# Altium schematic sheet ESP_2PIN_DS18_NTC.SchDoc
size A3
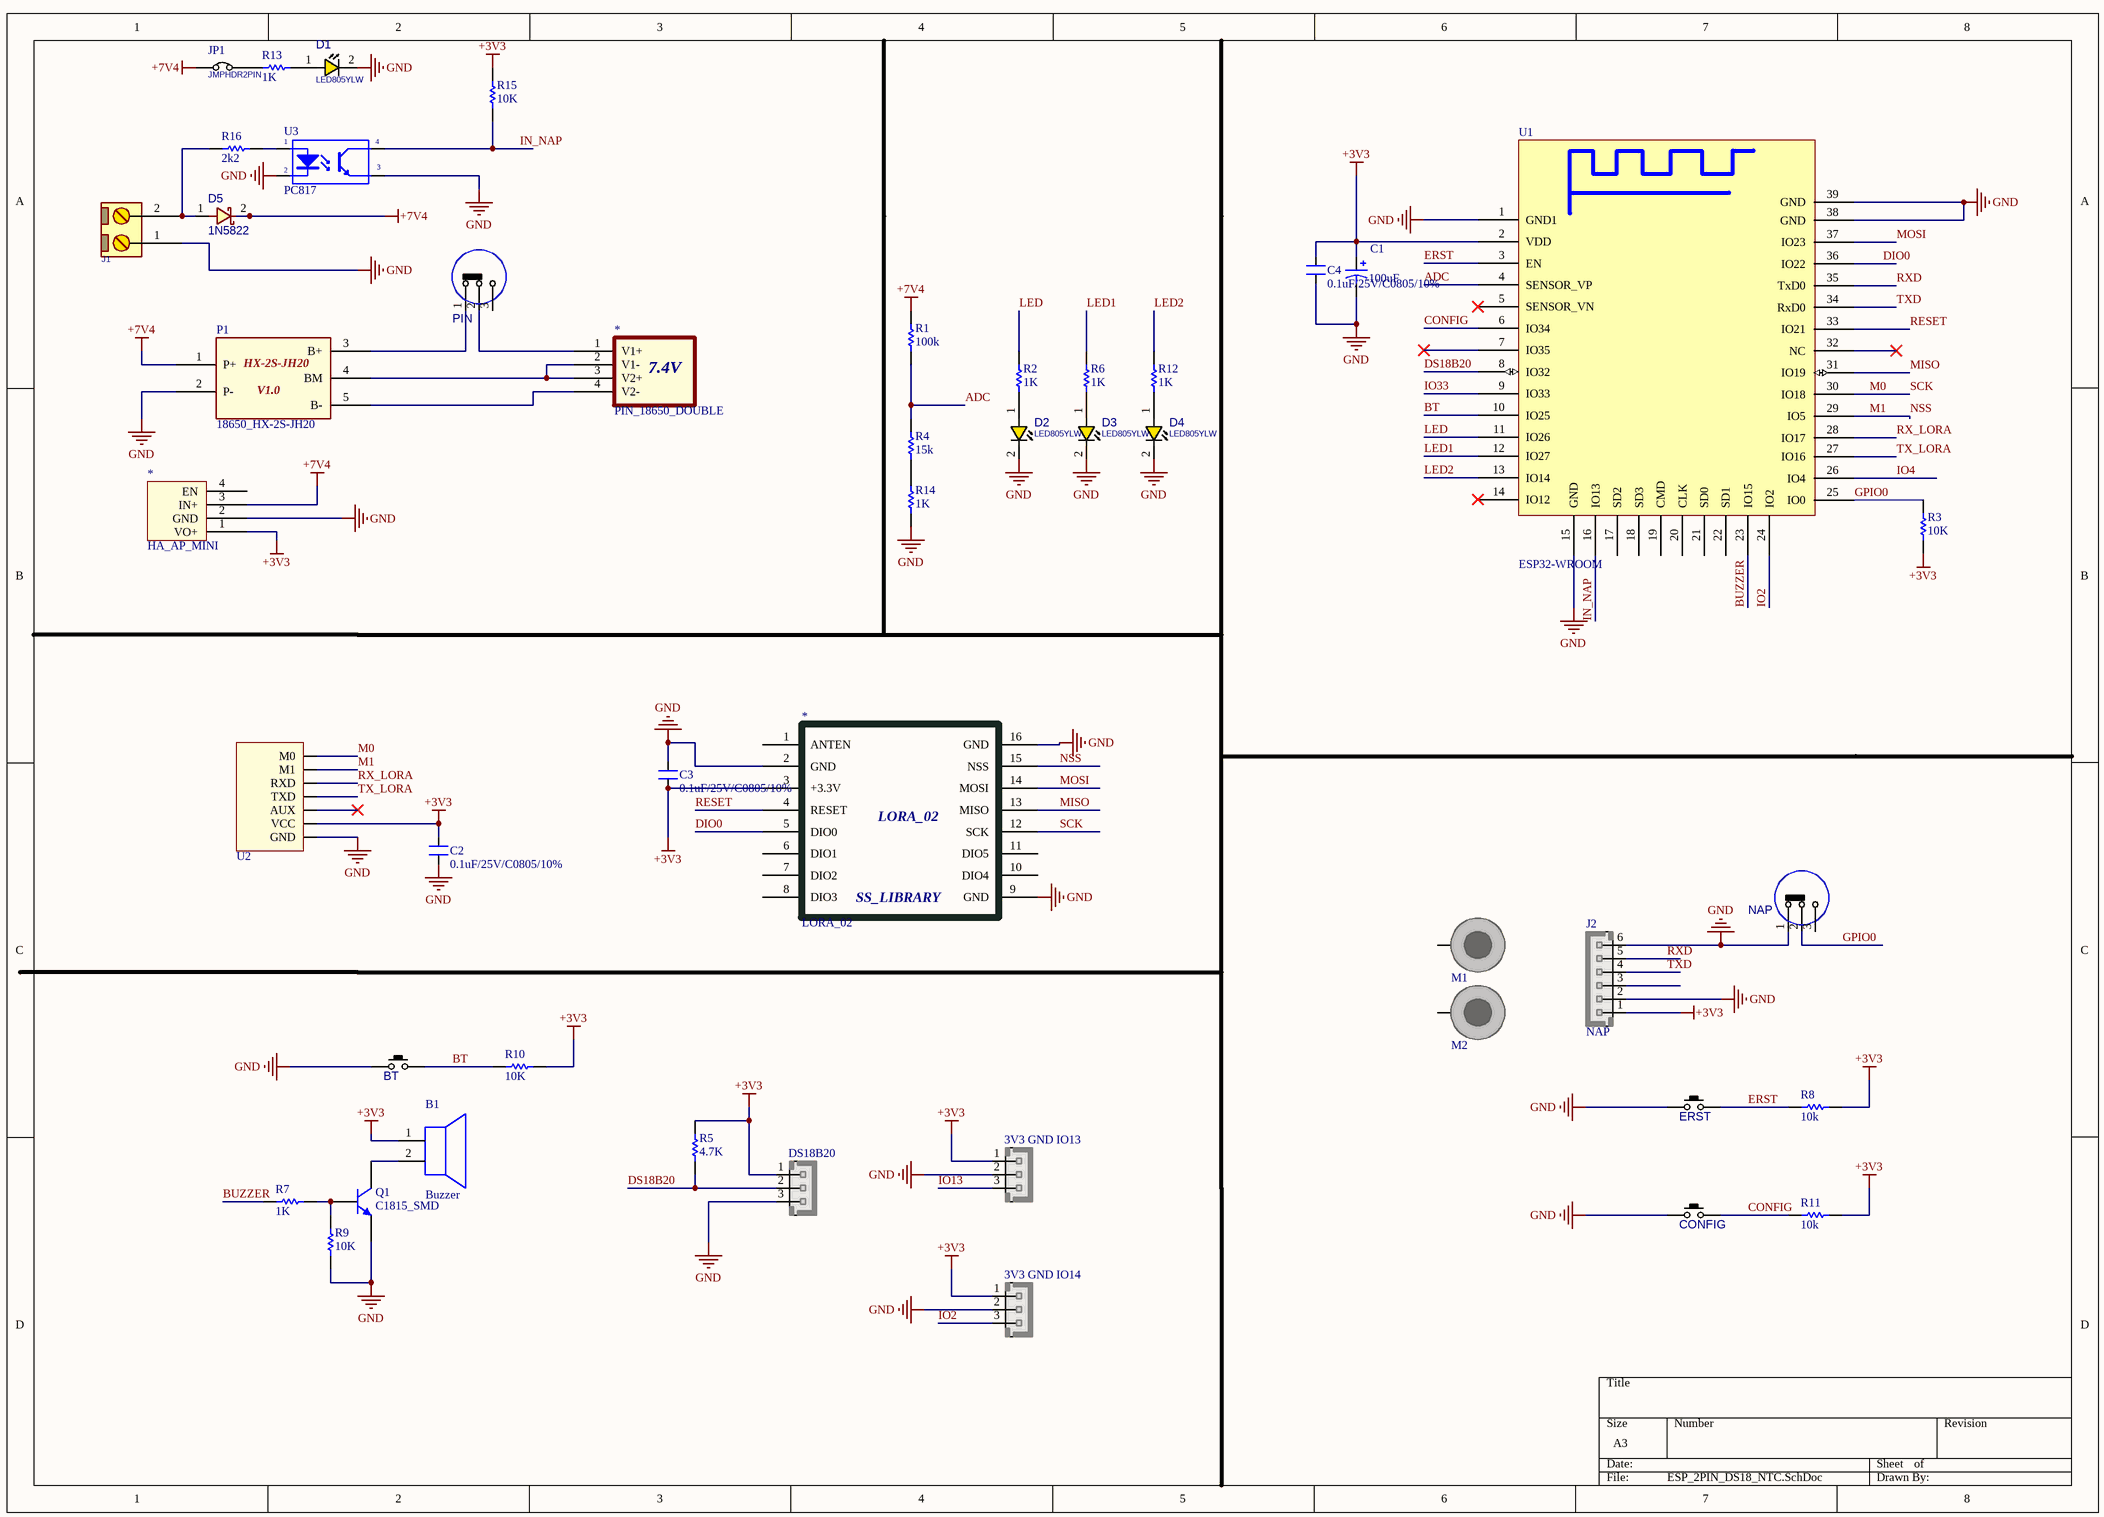
[diagram p0: ESP_2PIN_DS18_NTC.SchDoc]

## Parts
(Parts that share a designator on the sheet are numbered #1, #2 ... from top to bottom, then left to right.)
3V3_GND_IO13  HHDR_3  [XH_3]  (value not drawn)
3V3_GND_IO14  HHDR_3  [XH_3]  (value not drawn)
*#1  PIN_18650_DOUBLE  [2PIN_18650]
*#2  HA_AP_MINI  [HA_AP_MINI]
*#3  LORA_02  [LORA_02_SMD]
B1  Buzzer  [Buzzer]
BT  PUSHBUTTON  [SWPBS_SPST_6X3X5]  (value not drawn)
C1  100uF  [CAP TANT CASE X SMD]
C2  0.1uF/25V/C0805/10%  [CAP_CERA_C2012(CC0805INCH)]
C3  0.1uF/25V/C0805/10%  [CAP_CERA_C2012(CC0805INCH)]
C4  0.1uF/25V/C0805/10%  [CAP_CERA_C2012(CC0805INCH)]
CONFIG  PUSHBUTTON  [SWPBS_SPST_6X3X5]  (value not drawn)
D1  LED805YLW  [LED0805YLW]
D2  LED805YLW  [LED0805YLW]
D3  LED805YLW  [LED0805YLW]
D4  LED805YLW  [LED0805YLW]
D5  1N5822  [D_AX06_DO27]
DS18B20  HHDR_3  [XH_3]  (value not drawn)
ERST  PUSHBUTTON  [SWPBS_SPST_6X3X5]  (value not drawn)
J1  CONN_TB2  [TBG_2]  (value not drawn)
J2  NAP  [XH_6]
JP1  JMPHDR2PIN  [JUMP_2PIN]
M1  DNP/MH  [SCMH_M4FT]  (value not drawn)  (no BOM)
M2  DNP/MH  [SCMH_M4FT]  (value not drawn)  (no BOM)
NAP  SlideSwitch  [SWSLIDT_SPDT_S_8X4]  (value not drawn)
P1  18650_HX-2S-JH20  [18650_HX_2S]
PIN  SlideSwitch  [SWSLIDT_SPDT_S_8X4]  (value not drawn)
Q1  C1815_SMD  [trans_smd]
R1  100k  [Res 0805 SMD]
R2  1K  [Res 0805 SMD]
R3  10K  [Res 0805 SMD]
R4  15k  [Res 0805 SMD]
R5  4.7K  [Res 0805 SMD]
R6  1K  [Res 0805 SMD]
R7  1K  [Res 0805 SMD]
R8  10k  [Res 0805 SMD]
R9  10K  [Res 0805 SMD]
R10  10K  [Res 0805 SMD]
R11  10k  [Res 0805 SMD]
R12  1K  [Res 0805 SMD]
R13  1K  [Res 0805 SMD]
R14  1K  [Res 0805 SMD]
R15  10K  [Res 0805 SMD]
R16  2k2  [Res 0805 SMD]
U1  ESP32-WROOM  [ESP32-WROOM-32U - duplicate]
U2  RF_LoraE32  [RF_LoraE32]  (value not drawn)
U3  PC817  [DIP_4SMD]

## Nets
+3V3: 3V3_GND_IO13.1 3V3_GND_IO14.1 *#2.1(VO+) *#3.3(+3.3V) B1.1(+) C1.1 C2.2 C3.1 C4.2 DS18B20.1 J2.1 R3.1 R5.2 R8.1 R10.1 R11.1 R15.1 U1.2(VDD) U2.2(VCC)
+7V4: *#2.3(IN+) D5.2(K) JP1.1 P1.1(P+) R1.2
GND: 3V3_GND_IO13.2 3V3_GND_IO14.2 *#2.2(GND) *#3.2(GND) *#3.9(GND) *#3.16(GND) BT.1(P1) C1.2 C2.1 C3.2 C4.1 CONFIG.1(P1) D1.2(CATHODE) D2.2(CATHODE) D3.2(CATHODE) D4.2(CATHODE) DS18B20.3 ERST.1(P1) J1.1 J2.2 J2.6 NAP.1(P1) P1.2(P-) Q1.2(E) R9.1 R14.1 U1.1(GND1) U1.15(GND) U1.38(GND) U1.39(GND) U2.1(GND) U3.2(K) U3.3(E)
ADC: R1.1 R4.2 U1.4(SENSOR_VP)
BT: BT.2(P3) R10.2 U1.10(IO25)
BUZZER: R7.2 U1.23(IO15)
CONFIG: CONFIG.2(P3) R11.2 U1.6(IO34)
DIO0: *#3.5(DIO0) U1.36(IO22)
DS18B20: DS18B20.2 R5.1 U1.8(IO32)
ERST: ERST.2(P3) R8.2 U1.3(EN)
GPIO0: NAP.2(P3) R3.2 U1.25(IO0)
IN_NAP: R15.2 U1.16(IO13) U3.4(C)
IO2: 3V3_GND_IO14.3 U1.24(IO2)
IO4: U1.26(IO4)
IO13: 3V3_GND_IO13.3
IO33: U1.9(IO33)
LED: R2.2 U1.11(IO26)
LED1: R6.2 U1.12(IO27)
LED2: R12.2 U1.13(IO14)
M0: *#3.12(SCK) U1.30(IO18) U2.7(M0)  [also labelled SCK]
M1: *#3.15(NSS) U1.29(IO5) U2.6(M1)  [also labelled NSS]
MISO: *#3.13(MISO) U1.31(IO19)
MOSI: *#3.14(MOSI) U1.37(IO23)
RESET: *#3.4(RESET) U1.33(IO21)
RX_LORA: U1.28(IO17) U2.5(RXD)
RXD: J2.5 U1.35(TxD0)
TX_LORA: U1.27(IO16) U2.4(TXD)
TXD: J2.4 U1.34(RxD0)
Net*#1_1: *#1.1(V1+) PIN.2(P3)
Net*#1_2: *#1.2(V1-) *#1.3(V2+) P1.4(BM)
Net*#1_4: *#1.4(V2-) P1.5(B-)
NetB1_2: B1.2(-) Q1.3(C)
NetD1_1: D1.1(ANODE) R13.1
NetD2_1: D2.1(ANODE) R2.1
NetD3_1: D3.1(ANODE) R6.1
NetD4_1: D4.1(ANODE) R12.1
NetD5_1: D5.1(A) J1.2 R16.2
NetJP1_2: JP1.2 R13.2
NetP1_3: P1.3(B+) PIN.1(P1)
NetQ1_1: Q1.1(B) R7.1 R9.2
NetR4_1: R4.1 R14.2
NetR16_1: R16.1 U3.1(A)

Not connected (* = marked no-connect by the designer): *#2 4(EN); *#3 1(ANTEN) 6(DIO1) 7(DIO2) 8(DIO3) 10(DIO4) 11(DIO5); J2 3; M1 1; M2 1; NAP 3(P4); PIN 3(P4); U1 5(SENSOR_VN)* 7(IO35)* 14(IO12)* 17(SD2) 18(SD3) 19(CMD) 20(CLK) 21(SD0) 22(SD1) 32(NC)*; U2 3(AUX)*

## Notes on the sheet
- (in symbol 18650_HX-2S-JH20) HX-2S-JH20; V1.0
- (in symbol LORA_02) SS_LIBRARY
- (in symbol PIN_18650_DOUBLE) 7.4V

## Library data of the parts
3V3_GND_IO13 3V3_GND_IO14 DS18B20 = XH_3: JST-XH pitch: 2.5mm; VALUE: HHDR_3
BT CONFIG ERST = SWPBS_SPST_6X3X5: SWITCH, PUSH BUTTON, TACTILE, SMD, SPST, 6X3.5X5mm; MANF: ALPS; DESC: DESCRIPTION; MANF_P#: SKQMBBE010; VALUE: PUSHBUTTON; ASSEMBLY: ASSEMBLY; PARAM: PARAM; PRICE: PRICE
C1 = CAP_100uF/6.3V/SIZE B/20%: CAP TANT 100UF 6.3V 20% 1411; Manufacturer: Kemet; Manufacturer Part Number: T491B107M006AT; Manufacturer Size Code: B; Capacitance: 100µF; ESR (Equivalent Series Resistance): 3 Ohm; Type: Molded; Lifetime @ Temp.: 2000 Hrs @ 85°C; RoHS: RoHS Compliant; Category: Capacitors; Packaging: Cut Tape (CT); Tolerance: ±20%; Voltage - Rated: 6.3V; Operating Temperature: -55°C ~ 125°C; Mounting Type: Surface Mount; Package / Case: 1411 (3528 Metric); Size / Dimension: 0.138" L x 0.110" W (3.50mm x 2.80mm); Height - Seated (Max): 0.083" (2.10mm); Lead Spacing: -; Features: General Purpose; ComponentLink1URL: http://www.kemet.com/Lists/ProductCatalog/Attachments/254/KEM_T2005_T491.pdf; ComponentLink1Description: http://www.kemet.com/Lists/ProductCatalog/Attachments/254/KEM_T2005_T491.pdf; Supplier 1: Digi-Key; Supplier Part Number 1: 399-3710-1-ND
C2-C4 = CAP CERA 0805: CERAMIC CAP 0805; Value: 100pF, 2012
D1-D4 = LED_SMD_0805_YLW: LED, SMD, 0805, YELLOW; DESC: DESCRIPTION; MANF_P#: MANF_PART#; PARAM2: 2.2V; MANF: MANF; ASSEMBLY: ASSEMBLY; PRICE: 36t@Javan; VALUE: LED805YLW
D5 = DIODE_THD_SCHOTTKY_1N5822: DIODE, SCHOTTKY, 40V, 3A; MANF: Diodes; DESC: DESCRIPTION; MANF_P#: 1N5822; ASSEMBLY: ASSEMBLY; PRICE: PRICE; PARAM2: 3A; PARAM: 40V; VALUE: 1N5822
J1 = CONN_TB2: CONN, TERMINAL BLOCK, 5.08mm pitch; VALUE: CONN_TB2
J2 = XH_6: JST-XH pitch: 2.5mm; MANF_P#: JST-S6B-XHA; MANF: JST; VALUE: NAP
JP1 = JUMPER_HDR_2P: JUMPER, HEADER 2PIN; MANF: MANF; MANF_P#: MANF_P#; VALUE: JMPHDR2PIN
M1 M2 = SCMH_M4FT: SCREW mouting, M4, 4mm diameter and 8.0mm, FlatHead; ASSEMBLY: DNP; VALUE: DNP/MH
NAP PIN = SWSLIDT_SPDT_S_8X4: SWITCH, SLIDE, SPDT, 8.6X4.3mm, THD; MANF_PART#: OS102011MS2QN1; MANF: C&K; DESC: DESCRIPTION; VALUE: SlideSwitch; ASSEMBLY: ASSEMBLY; PARAM: PARAM; PRICE: 0.4$
Q1 = C1815_SMD: NPN General Purpose Amplifier; Published: 8-Jun-2000; LatestRevisionDate: 15-Jan-2003; LatestRevisionNote: PCB Footprint 'BCY-W3/D4.7' replaced; DatasheetVersion: 1997; PackageVersion: Sep-1998; PackageReference: TO-92A; Publisher: Altium Limited; Code_JEDEC: TO-92A; ComponentLink1Description: Manufacturer Link; ComponentLink1URL: http://www.fairchildsemi.com/; ComponentLink2Description: Datasheet; ComponentLink2URL: http://www.fairchildsemi.com/ds/2N%2F2N3904.pdf
R1-R16 = 34.8K/R0805/1%_1: Thick Film Resistors - SMD 34.8K OHM 1% 0805; Manufacturer: Yageo; Manufacturer Part Number: RC0603FR-0734K8L; Power Rating: 100mW; Resistance: 34.8kR; Voltage Rating: 50V; Temperature Coefficient: 100ppm/°C; Supplier 1: Digi-Key; Stock 1: 82861; Pricing 1: 1=0.1, 10=0.026, 100=0.0107, 1000=0.0048, 2500=0.0042 (USD); Case/Package: 0603; Case Code (Imperial): 0603; Case Code (Metric): 1608; Min Operating Temperature: -55°C; Max Operating Temperature: 155°C; Tolerance: 1%; Packaging: Tape and Reel; Termination: SMD/SMT; Composition: Thick Film; Military Standard: Not; Voltage Rating (DC): 50V; Length: 1.6mm; Height: 0.45mm; Width: 0.8mm; Depth: 0.8mm; Lead Free: Lead Free; Supplier Part Number 1: 311-34.8KHRCT-ND
U1 = ESP32-WROOM: ESP32-WROOM Wi-Fi Module by AI-Thinker; IC: ESP8266-EX; Vendor: Ai-thinker
U3 = PC817: Single Opto; Value: PC817